# EAGLE design Cockpit (EAGLE 5.01)
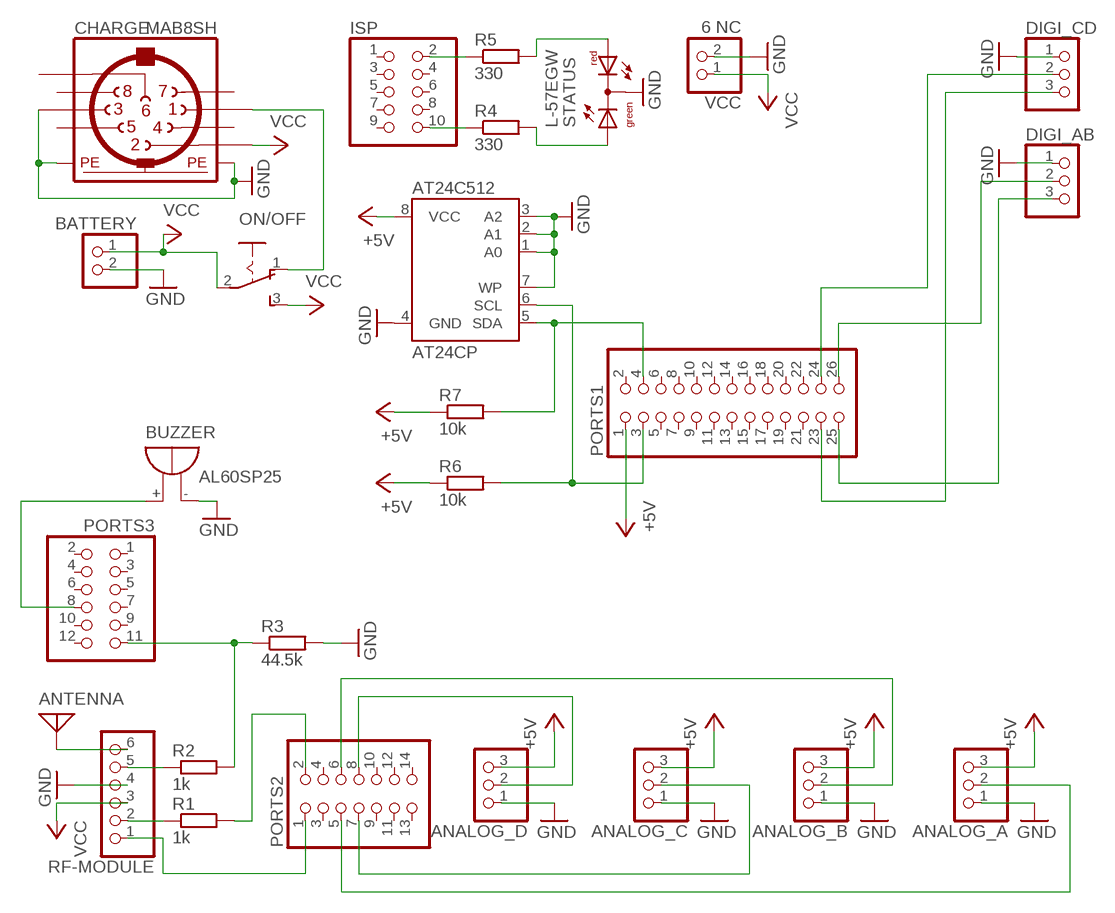
[diagram p0: schematic, sheet 1]

## Parts
ANALOG_A  PINHD-1X3  [1X03]
ANALOG_B  PINHD-1X3  [1X03]
ANALOG_C  PINHD-1X3  [1X03]
ANALOG_D  PINHD-1X3  [1X03]
ANTENNA  ANTENNA  [PAD-01]
AT24C512  AT24CP  [DIL08]
BATTERY  PINHD-1X2  [1X02]
BUZZER  AL60SP25  F/TMB  [F/TMB]
CHARGE  MAB8SH  [MAB8SH]
DIGI_AB  PINHD-1X3  [1X03]
DIGI_CD  PINHD-1X3  [1X03]
ISP  PINHD-2X5  [2X05]
ON/OFF  255SB  [255SB]
PORTS1  PINHD-2X13  [2X13]
PORTS2  PINHD-2X7  [2X07]
PORTS3  PINHD-2X6  [2X06]
R1  1k  R-EU_0204/7  [0204/7]
R2  1k  R-EU_0204/7  [0204/7]
R3  44.5k  R-EU_0204/7  [0204/7]
R4  330  R-EU_0204/7  [0204/7]
R5  330  R-EU_0204/7  [0204/7]
R6  10k  R-EU_0204/7  [0204/7]
R7  10k  R-EU_0204/7  [0204/7]
RF-MODULE  PINHD-1X6  [1X06]
STATUS  L-57EGW  DUOLED-RG-C  [DUOLED-C-5MM]
VCC  6 NC  PINHD-1X2  [1X02]

## Nets
A0: DIGI_AB.2 PORTS1.26
A1: DIGI_AB.3 PORTS1.25
A2: DIGI_CD.2 PORTS1.24
A3: DIGI_CD.3 PORTS1.23
B0: BUZZER.+ PORTS3.8
BATTERY: CHARGE.2 ON/OFF.3(S) RF-MODULE.3 VCC.1 ; supply symbol labelled VCC
BATTERYCHARGE: CHARGE.1 ON/OFF.1(O)
BATTERYIN: BATTERY.1 ON/OFF.2(P) ; supply symbol labelled VCC
D0: AT24C512.6(SCL) PORTS1.3 R6.2
D1: AT24C512.5(SDA) PORTS1.4 R7.2
E0: ISP.2 R5.1
E1: ISP.10 R4.1
E2: PORTS2.2 R1.2
E3: PORTS2.1 RF-MODULE.1
E4: PORTS3.11 R2.2 R3.1
F0: ANALOG_A.2 PORTS2.5
F1: ANALOG_B.2 PORTS2.6
F2: ANALOG_C.2 PORTS2.7
F3: ANALOG_D.2 PORTS2.8
GND: ANALOG_A.1 ANALOG_B.1 ANALOG_C.1 ANALOG_D.1 AT24C512.1(A0) AT24C512.2(A1) AT24C512.3(A2) AT24C512.4(GND) AT24C512.7(WP) BATTERY.2 BUZZER.- CHARGE.3 CHARGE.PE CHARGE.PE@(PE) DIGI_AB.1 DIGI_CD.1 R3.2 RF-MODULE.4 STATUS.C VCC.2
RF: ANTENNA.1 RF-MODULE.6
RF_ACTIVE: R2.1 RF-MODULE.5
RF_ENABLE: R1.1 RF-MODULE.2
STATUSGREEN: R4.2 STATUS.AX(AG)
STATUSRED: R5.2 STATUS.AR
VCC: ANALOG_A.3 ANALOG_B.3 ANALOG_C.3 ANALOG_D.3 AT24C512.8(VCC) PORTS1.1 R6.1 R7.1 ; supply symbol labelled +5V
Unconnected: CHARGE.4 CHARGE.5 CHARGE.6 CHARGE.7 CHARGE.8 ISP.1 ISP.3 ISP.4 ISP.5 ISP.6 ISP.7 ISP.8 ISP.9 PORTS1.2 PORTS1.5 PORTS1.6 PORTS1.7 PORTS1.8 PORTS1.9 PORTS1.10 PORTS1.11 PORTS1.12 PORTS1.13 PORTS1.14 PORTS1.15 PORTS1.16 PORTS1.17 PORTS1.18 PORTS1.19 PORTS1.20 PORTS1.21 PORTS1.22 PORTS2.3 PORTS2.4 PORTS2.9 PORTS2.10 PORTS2.11 PORTS2.12 PORTS2.13 PORTS2.14 PORTS3.1 PORTS3.2 PORTS3.3 PORTS3.4 PORTS3.5 PORTS3.6 PORTS3.7 PORTS3.9 PORTS3.10 PORTS3.12

## Library data of the parts
ANALOG_A ANALOG_B ANALOG_C ANALOG_D DIGI_AB DIGI_CD = pinhead:PINHD-1X3: PIN HEADER
ANTENNA = discrete:ANTENNA: Antenna
AT24C512 = atmel:AT24C*: 2-wire serial EEPROM
BATTERY VCC = pinhead:PINHD-1X2: PIN HEADER
BUZZER = buzzer:F/TMB: BUZZER Source: Buerklin
CHARGE = con-hirschmann:MAB8SH: Female CONNECTOR 8 pins with shield, horizontal (DIN 41524)
ISP = pinhead:PINHD-2X5: PIN HEADER
ON/OFF = switch:255SB: SLIDING SWITCH Distributor Buerklin, 11G810
PORTS1 = pinhead:PINHD-2X13: PIN HEADER
PORTS2 = pinhead:PINHD-2X7: PIN HEADER
PORTS3 = pinhead:PINHD-2X6: PIN HEADER
R1-R7 = resistor:R-EU_: RESISTOR, European symbol
RF-MODULE = pinhead:PINHD-1X6: PIN HEADER
STATUS = led:DUOLED-RG-C: DUO LED 2 colors (red/green), 5 mm, round, common Cathode www.ligitek.com or other producers.

## Board
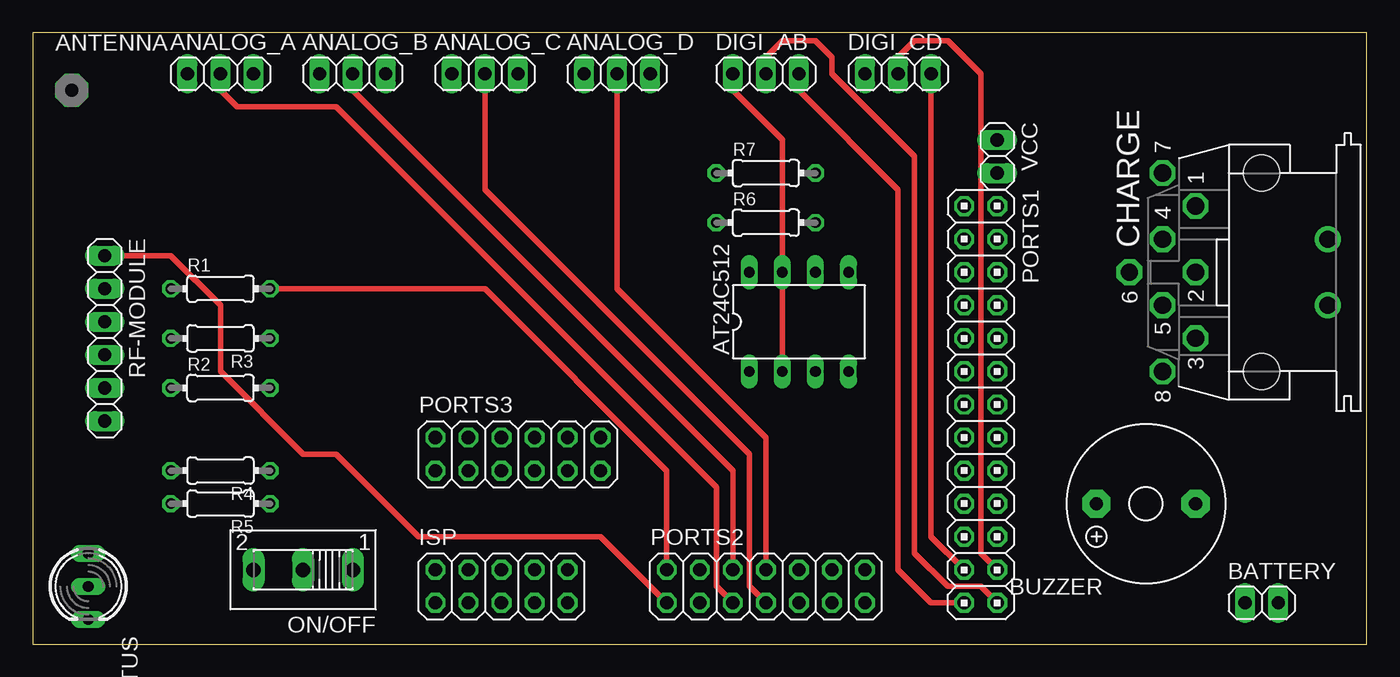
[diagram p1: board, top side]
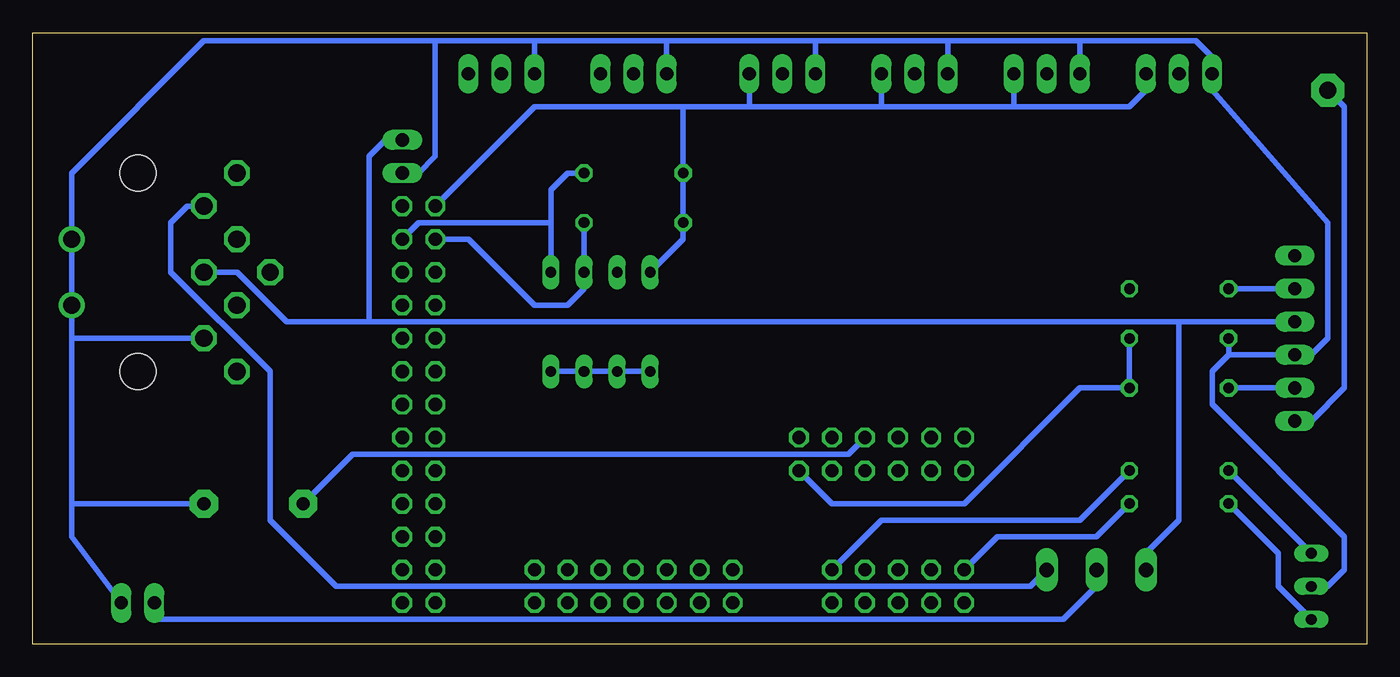
[diagram p2: board, bottom side, seen from below]

Size 102.54 x 46.98 mm. Coordinates in mm from the lower left corner, seen from the top.
Outline: 0,0 102.54,0 102.54,46.98 0,46.98 0,0
Copper layers (1*16): Top 0.035mm / dielectric 1.5mm / Bottom 0.035mm
Design rules "default": minimum track width 10mil, minimum drill 24mil, track to track 8mil, track to pad 8mil, pad to pad 8mil, via to via 8mil, smd to smd 8mil, copper to edge 40mil, drill to drill 8mil, minimum pad ring 10mil, minimum via ring 8mil, stop-mask expansion 4mil, vias tented up to drill 0mil, thermal gap 10mil

### Footprints (pad centres in the part's own frame; a part is rotated, then mirrored left to right if it is on the bottom)
1X03 = drill 1.016 long: 1 -2.54,0; 2 0,0; 3 2.54,0
PAD-01 = drill 1.321 pad 2.54 octagon: 1 0,0
DIL08 = drill 0.813 long: 1 -3.81,-3.81; 2 -1.27,-3.81; 3 1.27,-3.81; 4 3.81,-3.81; 5 3.81,3.81; 6 1.27,3.81; 7 -1.27,3.81; 8 -3.81,3.81
1X02 = drill 1.016 long: 1 -1.27,0; 2 1.27,0
F/TMB = drill 1.016 pad 2.159 octagon: + 3.81,0; - -3.81,0
MAB8SH = drill 1.321 octagon: 1 5.08,5.08; 2 0,5.08; 3 -5.08,5.08; 4 2.54,7.62; 5 -2.54,7.62; 6 0,10.16; 7 7.62,7.62; 8 -7.62,7.62 | drill 1.321 round: PE -2.54,-5.08; PE@ 2.54,-5.08 | hole 2.794: -7.62,0; 7.62,0
2X05 = drill 1.016 octagon: 1 -5.08,-1.27; 2 -5.08,1.27; 3 -2.54,-1.27; 4 -2.54,1.27; 5 0,-1.27; 6 0,1.27; 7 2.54,-1.27; 8 2.54,1.27; 9 5.08,-1.27; 10 5.08,1.27
255SB = drill 1.118 long: 1 -3.81,0; 2 0,0; 3 3.81,0
2X13 = drill 1.016 octagon: 1 -15.24,-1.27; 2 -15.24,1.27; 3 -12.7,-1.27; 4 -12.7,1.27; 5 -10.16,-1.27; 6 -10.16,1.27; 7 -7.62,-1.27; 8 -7.62,1.27; 9 -5.08,-1.27; 10 -5.08,1.27; 11 -2.54,-1.27; 12 -2.54,1.27; 13 0,-1.27; 14 0,1.27; 15 2.54,-1.27; 16 2.54,1.27; 17 5.08,-1.27; 18 5.08,1.27; 19 7.62,-1.27; 20 7.62,1.27; 21 10.16,-1.27; 22 10.16,1.27; 23 12.7,-1.27; 24 12.7,1.27; 25 15.24,-1.27; 26 15.24,1.27
2X07 = drill 1.016 octagon: 1 -7.62,-1.27; 2 -7.62,1.27; 3 -5.08,-1.27; 4 -5.08,1.27; 5 -2.54,-1.27; 6 -2.54,1.27; 7 0,-1.27; 8 0,1.27; 9 2.54,-1.27; 10 2.54,1.27; 11 5.08,-1.27; 12 5.08,1.27; 13 7.62,-1.27; 14 7.62,1.27
2X06 = drill 1.016 octagon: 1 -6.35,-1.27; 2 -6.35,1.27; 3 -3.81,-1.27; 4 -3.81,1.27; 5 -1.27,-1.27; 6 -1.27,1.27; 7 1.27,-1.27; 8 1.27,1.27; 9 3.81,-1.27; 10 3.81,1.27; 11 6.35,-1.27; 12 6.35,1.27
0204/7 = drill 0.813 octagon: 1 -3.81,0; 2 3.81,0
1X06 = drill 1.016 long: 1 -6.35,0; 2 -3.81,0; 3 -1.27,0; 4 1.27,0; 5 3.81,0; 6 6.35,0
DUOLED-C-5MM = drill 0.813 long: AR 2.54,0; AX -2.54,0; C 0,0

### Placement (x,y rotation side)
ANALOG_A  14.44,43.81 0 top
ANALOG_B  24.6,43.81 0 top
ANALOG_C  34.76,43.81 0 top
ANALOG_D  44.92,43.81 0 top
ANTENNA  3.01,42.54 0 top
AT24C512  58.89,24.76 0 top
BATTERY  94.45,3.17 0 top
BUZZER  85.56,10.79 180 top
CHARGE  94.45,28.57 90 top
DIGI_AB  56.35,43.81 0 top
DIGI_CD  66.51,43.81 0 top
ISP  36.03,4.44 0 top
ON/OFF  20.79,5.71 180 top
PORTS1  72.86,18.41 270 top
PORTS2  56.35,4.44 0 top
PORTS3  37.3,14.6 0 top
R1  14.44,27.3 0 top
R2  14.44,19.68 0 top
R3  14.44,23.49 180 top
R4  14.44,13.33 180 top
R5  14.44,10.79 180 top
R6  56.35,32.38 0 top
R7  56.35,36.19 0 top
RF-MODULE  5.55,23.49 270 top
STATUS  4.28,4.44 270 top
VCC  74.13,37.46 270 top

### Tracks (layer width: path | path; a pad name or v marks a point on that pad's centre or on a via)
A0
  Top 0.406: PORTS1.26 72.86,4.44 70.32,4.44 67.78,6.98 67.78,37.46 61.43,43.81 61.43,45.08 60.16,46.35 57.62,46.35 56.35,45.08 DIGI_AB.2
A1
  Top 0.406: PORTS1.25 69.05,3.17 66.51,5.71 66.51,34.92 58.89,42.54 DIGI_AB.3
A2
  Top 0.406: PORTS1.24 72.86,6.98 72.86,43.81 70.32,46.35 67.78,46.35 66.51,45.08 DIGI_CD.2
A3
  Top 0.406: DIGI_CD.3 69.05,8.25 PORTS1.23
B0
  Bottom 0.406: PORTS3.8 39.84,14.6 77.94,14.6 BUZZER.+
BATTERY
  Bottom 0.406: RF-MODULE.3 14.44,24.76 | 76.67,24.76 76.67,37.46 75.4,38.73 VCC.1 | 76.67,24.76 83.02,24.76 86.83,28.57 CHARGE.2 | ON/OFF.3 16.98,6.98 14.44,9.52 14.44,24.76 | 14.44,24.76 76.67,24.76
BATTERYCHARGE
  Bottom 0.406: ON/OFF.1 25.87,4.44 79.21,4.44 84.29,9.52 84.29,20.95 91.91,28.57 91.91,32.38 90.64,33.65 CHARGE.1
BATTERYIN
  Bottom 0.406: BATTERY.1 93.18,1.9 23.33,1.9 20.79,4.44 ON/OFF.2
D0
  Bottom 0.406: R6.2 AT24C512.6 60.16,27.3 61.43,26.03 63.97,26.03 69.05,31.11 PORTS1.3
D1
  Bottom 0.406: R7.2 61.43,36.19 62.7,34.92 62.7,32.38 | AT24C512.5 62.7,32.38 | 62.7,32.38 72.86,32.38 PORTS1.4
E0
  Bottom 0.406: R5.1 20.79,8.25 28.41,8.25 ISP.2
E1
  Bottom 0.406: ISP.10 37.3,9.52 22.06,9.52 R4.1
E2
  Top 0.406: R1.2 34.76,27.3 48.73,13.33 PORTS2.2
E3
  Top 0.406: RF-MODULE.1 10.63,29.84 14.44,26.03 14.44,20.95 20.79,14.6 23.33,14.6 29.68,8.25 43.65,8.25 PORTS2.1
E4
  Bottom 0.406: R3.1 R2.2 22.06,19.68 30.95,10.79 41.11,10.79 PORTS3.11
F0
  Top 0.406: PORTS2.5 52.54,4.44 52.54,12.06 23.33,41.27 15.71,41.27 14.44,42.54 ANALOG_A.2
F1
  Top 0.406: PORTS2.6 53.81,13.33 24.6,42.54 ANALOG_B.2
F2
  Top 0.406: PORTS2.7 55.08,4.44 55.08,14.6 34.76,34.92 ANALOG_C.2
F3
  Top 0.406: PORTS2.8 56.35,15.87 44.92,27.3 ANALOG_D.2
GND
  Top 0.406: AT24C512.2 AT24C512.7 57.62,38.73 53.81,42.54 DIGI_AB.1
  Bottom 0.406: BATTERY.2 99.53,8.25 99.53,23.49 | 99.53,23.49 CHARGE.PE CHARGE.PE@ 99.53,36.19 89.37,46.35 71.59,46.35 | 22.06,46.35 13.17,46.35 11.9,45.08 ANALOG_A.1 11.9,42.54 3.01,32.38 3.01,23.49 4.28,22.22 RF-MODULE.4 10.63,22.22 | 22.06,46.35 ANALOG_B.1 | 53.81,46.35 63.97,46.35 | 63.97,46.35 DIGI_CD.1 | 63.97,46.35 71.59,46.35 | 53.81,46.35 DIGI_AB.1 | 42.38,46.35 53.81,46.35 | 42.38,46.35 ANALOG_D.1 | 32.22,46.35 42.38,46.35 | 32.22,46.35 ANALOG_C.1 | 22.06,46.35 32.22,46.35 | 99.53,23.49 CHARGE.3 | 71.59,46.35 71.59,37.46 72.86,36.19 VCC.2 | AT24C512.1 AT24C512.2 AT24C512.3 AT24C512.4 | 99.53,23.49 99.53,10.79 BUZZER.- | 10.63,22.22 R3.2 | STATUS.C 3.01,4.44 1.74,5.71 1.74,8.25 11.9,18.41 11.9,20.95 10.63,22.22
RF
  Bottom 0.406: ANTENNA.1 1.74,41.27 1.74,19.68 4.28,17.14 RF-MODULE.6
RF_ACTIVE
  Bottom 0.406: R2.1 RF-MODULE.5
RF_ENABLE
  Bottom 0.406: R1.1 RF-MODULE.2
STATUSGREEN
  Bottom 0.406: STATUS.AX R4.2
STATUSRED
  Bottom 0.406: STATUS.AR 6.82,4.44 6.82,6.98 R5.2
VCC
  Bottom 0.406: 47.46,41.27 ANALOG_D.3 | 47.46,41.27 37.3,41.27 ANALOG_C.3 | ANALOG_B.3 27.14,41.27 28.41,41.27 | 28.41,41.27 47.46,41.27 | ANALOG_A.3 16.98,42.54 18.25,41.27 28.41,41.27 | PORTS1.1 63.97,41.27 52.54,41.27 | 47.46,41.27 52.54,41.27 | AT24C512.8 52.54,31.11 R6.1 R7.1 52.54,41.27